# Altium schematic sheet zigbee.SchDoc
size A2
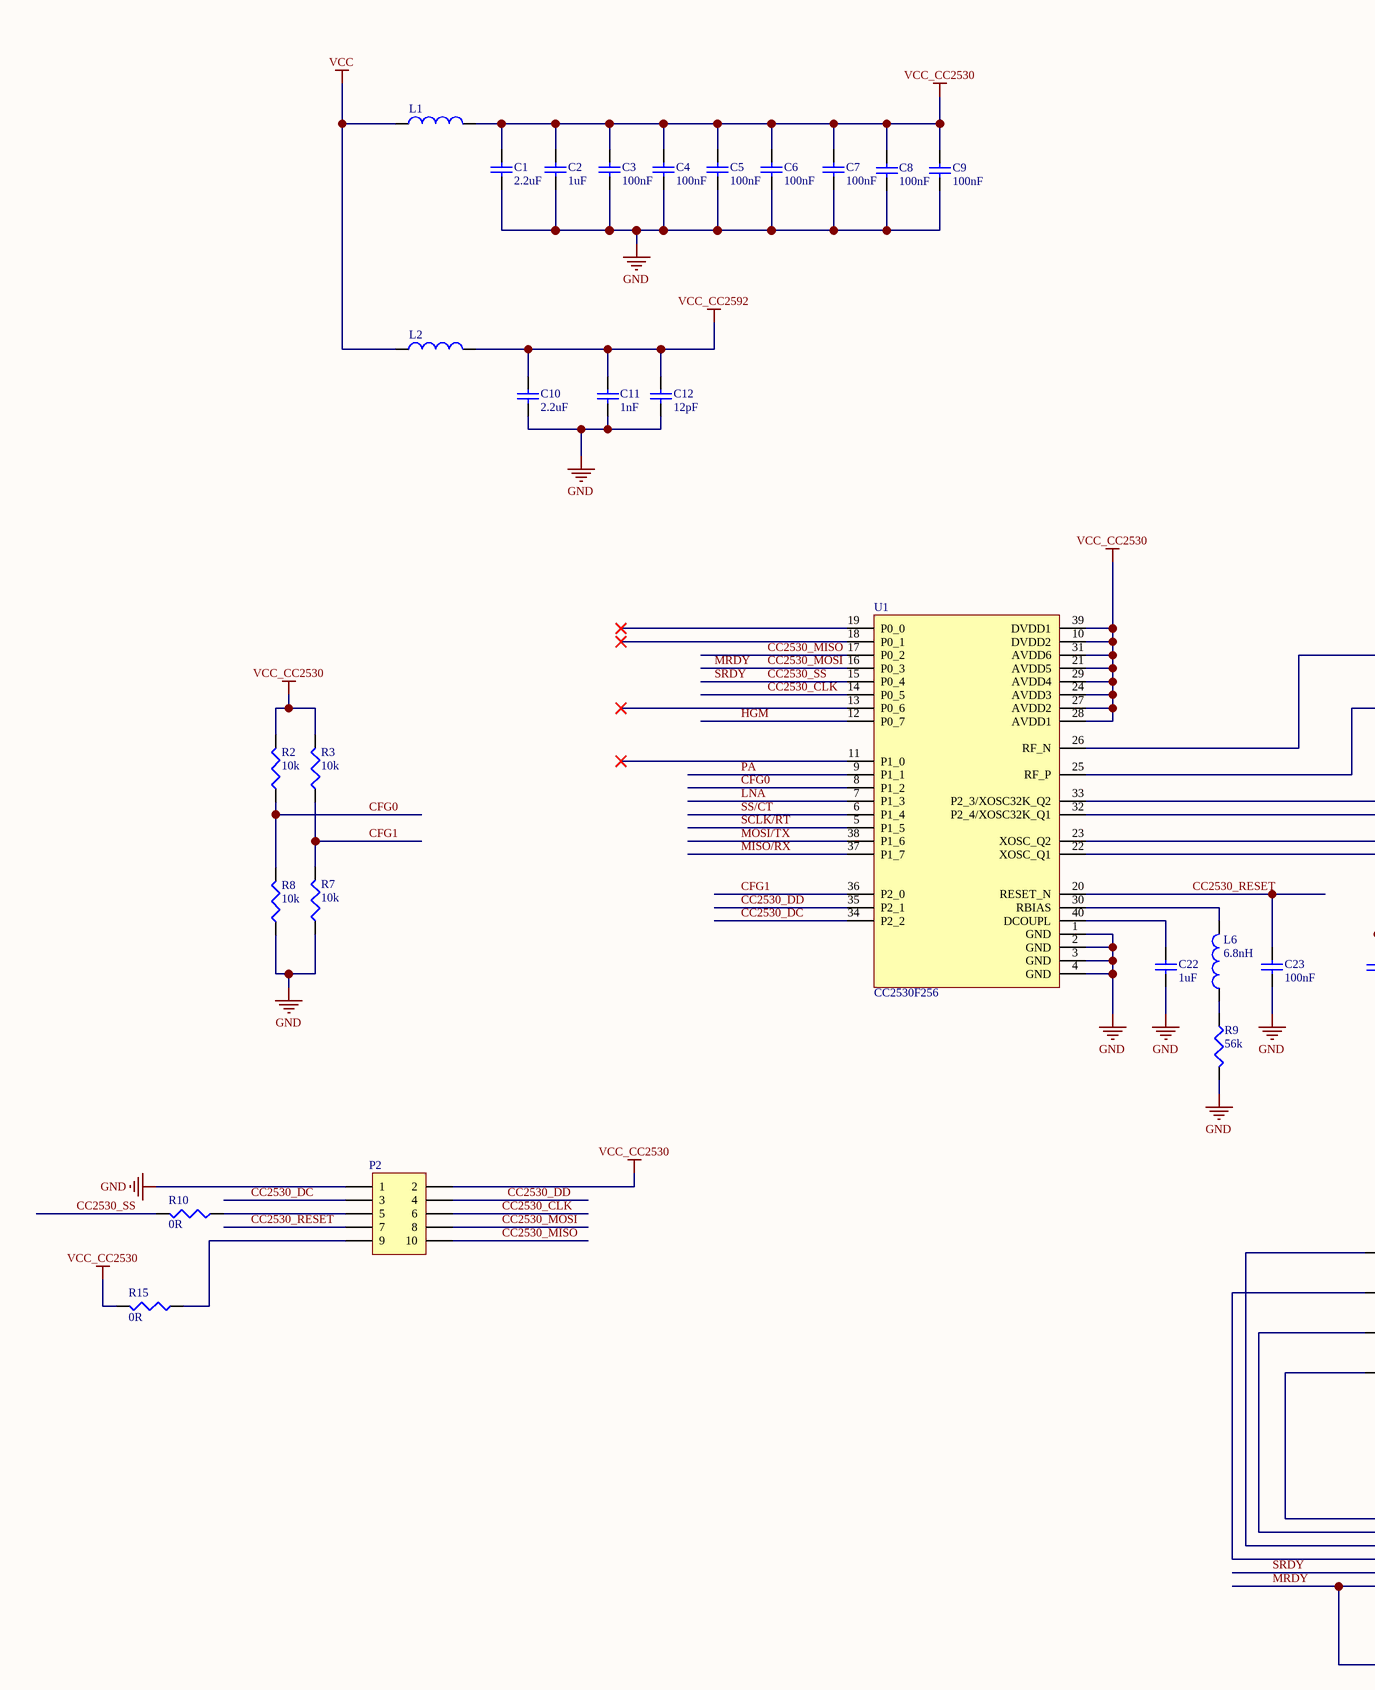
[diagram p0: zigbee.SchDoc, left]
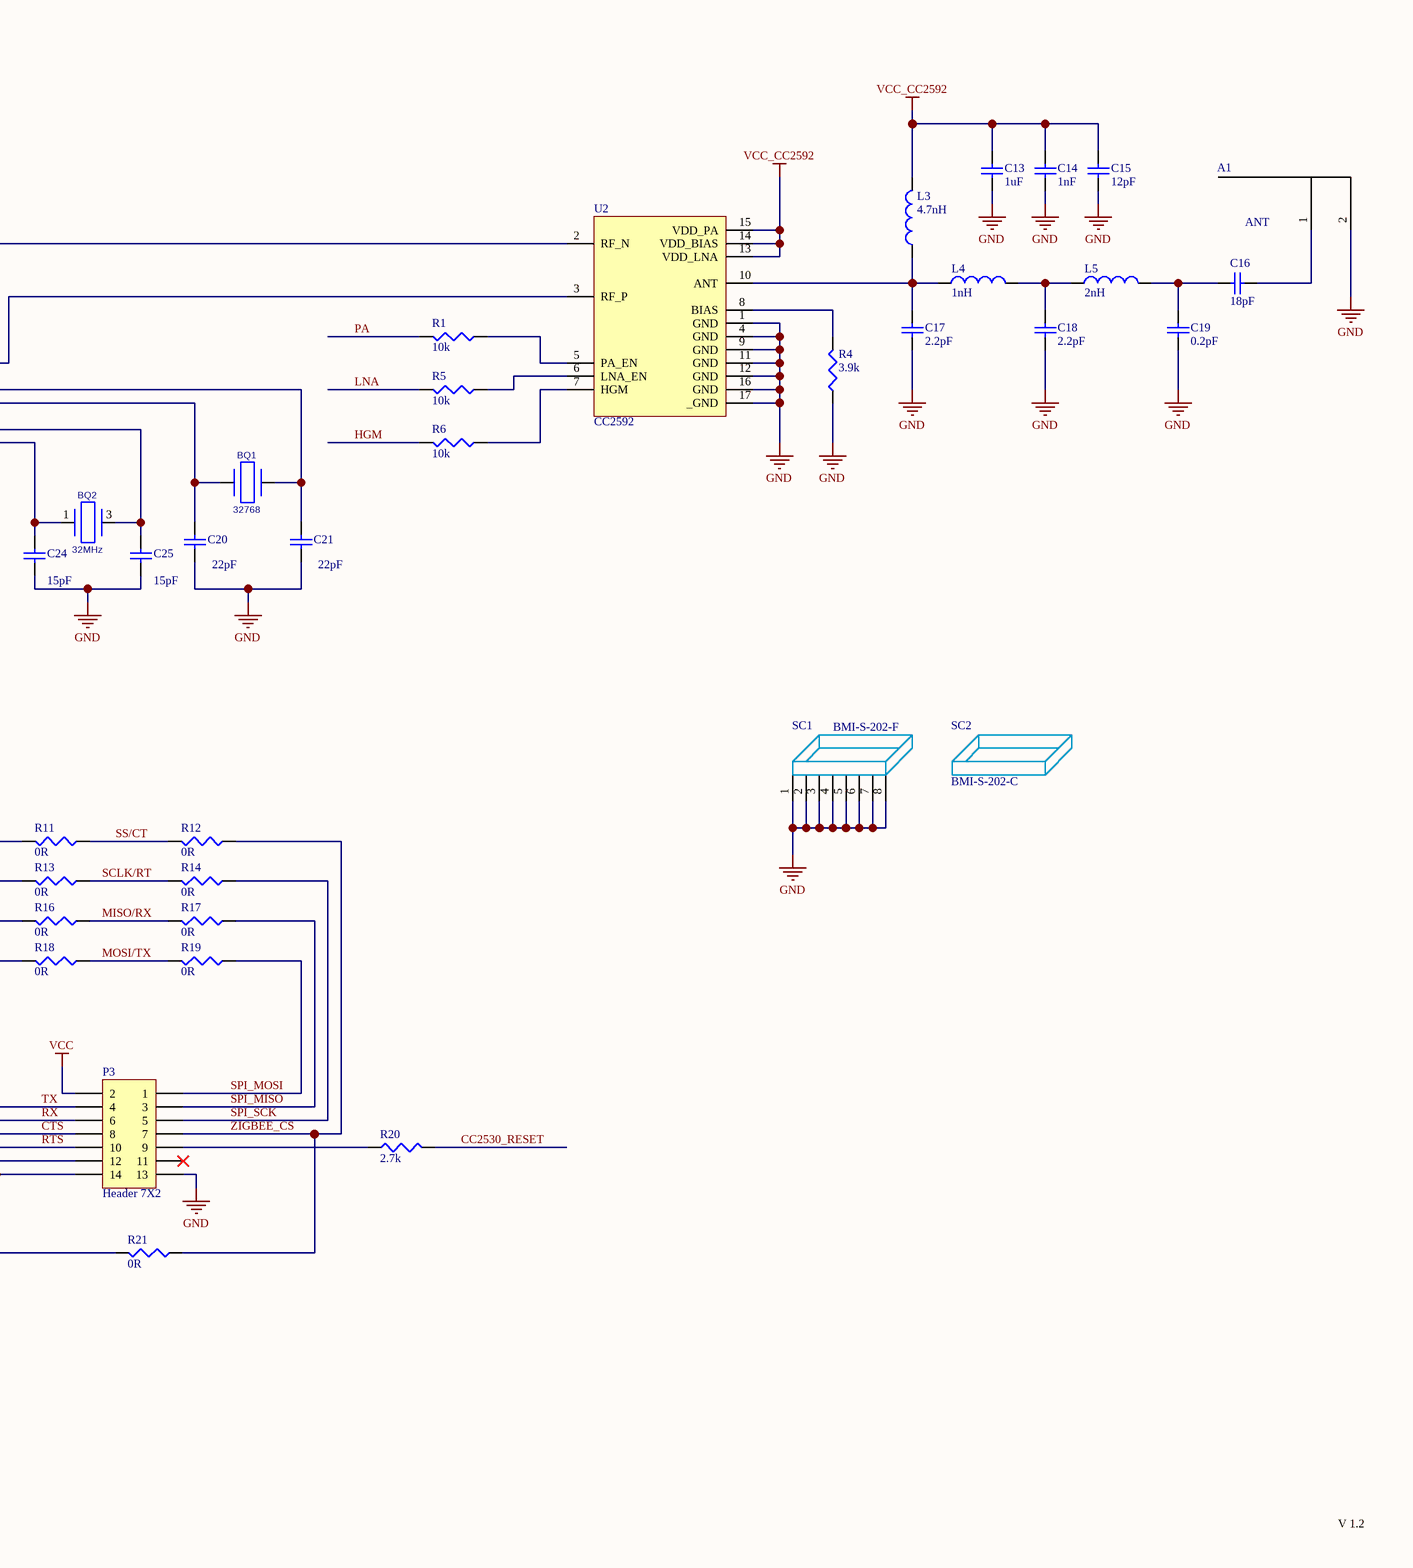
[diagram p1: zigbee.SchDoc, right]

## Parts
A1  ANT  [F ant]
BQ1  value 32768  [FC-12M]  (hidden comment: Crystal)
BQ2  value 32MHz  [403C11A32M00000]  (hidden comment: Crystal)
C1  value 2.2uF  [0402]  (hidden comment: Capacitor)
C2  value 1uF  [0402]  (hidden comment: Capacitor)
C3  value 100nF  [0402]  (hidden comment: Capacitor)
C4  value 100nF  [0402]  (hidden comment: Capacitor)
C5  value 100nF  [0402]  (hidden comment: Capacitor)
C6  value 100nF  [0402]  (hidden comment: Capacitor)
C7  value 100nF  [0402]  (hidden comment: Capacitor)
C8  value 100nF  [0402]  (hidden comment: Capacitor)
C9  value 100nF  [0402]  (hidden comment: Capacitor)
C10  value 2.2uF  [0402]  (hidden comment: Capacitor)
C11  value 1nF  [0402]  (hidden comment: Capacitor)
C12  value 12pF  [0402]  (hidden comment: Capacitor)
C13  value 1uF  [0402]  (hidden comment: Capacitor)
C14  value 1nF  [0402]  (hidden comment: Capacitor)
C15  value 12pF  [0402]  (hidden comment: Capacitor)
C16  value 18pF  [0402]  (hidden comment: Capacitor)
C17  value 2.2pF  [0402]  (hidden comment: Capacitor)
C18  value 2.2pF  [0402]  (hidden comment: Capacitor)
C19  value 0.2pF  [0402]  (hidden comment: Capacitor)
C20  value 22pF  [0402]  (hidden comment: Capacitor)
C21  value 22pF  [0402]  (hidden comment: Capacitor)
C22  value 1uF  [0402]  (hidden comment: Capacitor)
C23  value 100nF  [0402]  (hidden comment: Capacitor)
C24  value 15pF  [0402]  (hidden comment: Capacitor)
C25  value 15pF  [0402]  (hidden comment: Capacitor)
L1  Inductor  [0402]  (value not drawn)
L2  Inductor  [0603]  (value not drawn)
L3  value 4.7nH  [0402]  (hidden comment: Inductor)
L4  value 1nH  [0402]  (hidden comment: Inductor)
L5  value 2nH  [0402]  (hidden comment: Inductor)
L6  value 6.8nH  [0402]  (hidden comment: Inductor)
P2  *  [HDR2X5H]  (value not drawn)
P3  Header 7X2  [DIP14]
R1  value 10k  [0402]  (hidden comment: Resistor)
R2  value 10k  [0402]  (hidden comment: Resistor)
R3  value 10k  [0402]  (hidden comment: Resistor)
R4  value 3.9k  [0402]  (hidden comment: Resistor)
R5  value 10k  [0402]  (hidden comment: Resistor)
R6  value 10k  [0402]  (hidden comment: Resistor)
R7  value 10k  [0402]  (hidden comment: Resistor)
R8  value 10k  [0402]  (hidden comment: Resistor)
R9  value 56k  [0402]  (hidden comment: Resistor)
R10  value 0R  [0402]  (hidden comment: Blob)
R11  value 0R  [0402]  (hidden comment: Blob)
R12  value 0R  [0402]  (hidden comment: Blob)
R13  value 0R  [0402]  (hidden comment: Blob)
R14  value 0R  [0402]  (hidden comment: Blob)
R15  value 0R  [0402]  (hidden comment: Blob)
R16  value 0R  [0402]  (hidden comment: Blob)
R17  value 0R  [0402]  (hidden comment: Blob)
R18  value 0R  [0402]  (hidden comment: Blob)
R19  value 0R  [0402]  (hidden comment: Blob)
R20  value 2.7k  [0402]  (hidden comment: Resistor)
R21  value 0R  [0402]  (hidden comment: Blob)
SC1  BMI-S-202-F  [BMIS_202_F]
SC2  BMI-S-202-C
U1  CC2530F256  [QFN40]
U2  CC2592  [QFN16]

## Nets
GND: A1.2 C1.2 C2.2 C3.2 C4.2 C5.2 C6.2 C7.2 C8.2 C9.2 C10.2 C11.1 C12.1 C13.1 C14.1 C15.1 C17.1 C18.1 C19.1 C20.1 C21.1 C22.2 C23.2 C24.1 C25.1 P2.1 P3.13 R4.1 R7.2 R8.2 R9.2 SC1.1 SC1.2 SC1.3 SC1.4 SC1.5 SC1.6 SC1.7 SC1.8 U1.1(GND) U1.2(GND) U1.3(GND) U1.4(GND) U2.1(GND) U2.4(GND) U2.9(GND) U2.11(GND) U2.12(GND) U2.16(GND) U2.17(_GND)
VCC: L1.1 L2.1 P3.2
VCC_CC2530: C1.1 C2.1 C3.1 C4.1 C5.1 C6.1 C7.1 C8.1 C9.1 L1.2 P2.2 R2.1 R3.1 R15.2 U1.10(DVDD2) U1.21(AVDD5) U1.24(AVDD3) U1.27(AVDD2) U1.28(AVDD1) U1.29(AVDD4) U1.31(AVDD6) U1.39(DVDD1)
VCC_CC2592: C10.1 C11.2 C12.2 C13.2 C14.2 C15.2 L2.2 L3.2 U2.13(VDD_LNA) U2.14(VDD_BIAS) U2.15(VDD_PA)
CC2530_CLK: P2.6 U1.14(P0_5)
CC2530_DC: P2.3 U1.34(P2_2)
CC2530_DD: P2.4 U1.35(P2_1)
CC2530_MISO: P2.10 U1.17(P0_2)
CC2530_MOSI: P2.8 P3.14 R21.2 U1.16(P0_3)  [also labelled MRDY]
CC2530_RESET: C23.1 P2.7 R20.1 U1.20(RESET_N)
CC2530_SS: P3.12 R10.2 U1.15(P0_4)  [also labelled SRDY]
CFG0: R2.2 R8.1 U1.8(P1_2)
CFG1: R3.2 R7.1 U1.36(P2_0)
CTS: P3.8 R11.2
HGM: R6.1 U1.12(P0_7)
LNA: R5.1 U1.7(P1_3)
MISO/RX: R16.1 R17.2 U1.37(P1_7)
MOSI/TX: R18.1 R19.2 U1.38(P1_6)
PA: R1.1 U1.9(P1_1)
RTS: P3.10 R13.2
RX: P3.6 R16.2
SCLK/RT: R13.1 R14.2 U1.5(P1_5)
SPI_MISO: P3.3 R17.1
SPI_MOSI: P3.1 R19.1
SPI_SCK: P3.5 R14.1
SS/CT: R11.1 R12.2 U1.6(P1_4)
TX: P3.4 R18.2
ZIGBEE_CS: P3.7 R12.1 R21.1
NetA1_1: A1.1 C16.2
NetBQ1_1: BQ1.1 C20.2 U1.32(P2_4/XOSC32K_Q1)
NetBQ1_2: BQ1.2 C21.2 U1.33(P2_3/XOSC32K_Q2)
NetBQ2_1: BQ2.1 C24.2 U1.22(XOSC_Q1)
NetBQ2_3: BQ2.3 C25.2 U1.23(XOSC_Q2)
NetC16_1: C16.1 C19.2 L5.2
NetC17_2: C17.2 L3.1 L4.1 U2.10(ANT)
NetC18_2: C18.2 L4.2 L5.1
NetC22_1: C22.1 U1.40(DCOUPL)
NetL6_1: L6.1 R9.1
NetL6_2: L6.2 U1.30(RBIAS)
NetP2_5: P2.5 R10.1
NetP2_9: P2.9 R15.1
NetP3_9: P3.9 R20.2
NetR1_2: R1.2 U2.5(PA_EN)
NetR4_2: R4.2 U2.8(BIAS)
NetR5_2: R5.2 U2.6(LNA_EN)
NetR6_2: R6.2 U2.7(HGM)
NetU1_25: U1.25(RF_P) U2.3(RF_P)
NetU1_26: U1.26(RF_N) U2.2(RF_N)

Not connected (* = marked no-connect by the designer): P3 11*; U1 11(P1_0)* 13(P0_6)* 18(P0_1)* 19(P0_0)*

## Notes on the sheet
- V 1.2

## Library data of the parts
A1 = ANT: Inverted-F Antenna; Manufacturer Part Number: PCB ANT; Mount: 1; Manufacturer: *
BQ1 = 6LC:308C: CRYSTAL 32.768KHZ 12.5PF SMD; Manufacturer Part Number: FC-12M 32.7680KA-A3; Manufacturer: EPSON; Mount: 1
BQ2 = HC-49SMD: CRYSTAL 32MHZ 10PF SMD; Manufacturer: CTS-Frequency Controls; Manufacturer Part Number: 403C11A32M00000; Mount: 1
C1 C10 = Cap: CAP CER 2.2UF 6.3V 20% X5R 0402; Manufacturer Part Number: CL05A225MQ5NNNC; Manufacturer: Samsung Electro-Mechanics America, Inc; Mount: 1
C2 C13 C22 = Cap: CAP CER 1UF 6.3V 10% X5R 0402; Manufacturer Part Number: GRM155R60J105KE19D; Manufacturer: Murata Electronics North America; Mount: 1
C3-C9 C23 = Cap: CAP CER 0.1UF 10V 20% X5R 0402; Manufacturer Part Number: CL05A104MP5NNNC; Manufacturer: Samsung Electro-Mechanics America, Inc; Mount: 1
C11 C14 = Cap: CAP CER 10000PF 10V 10% X5R 0402; Manufacturer Part Number: GRM155R61A103KA01D; Manufacturer: Murata Electronics North America; Mount: 1
C12 C15 = Cap: CAP CER 12PF 50V 5% NP0 0402; Manufacturer Part Number: GRM1555C1H120JA01D; Manufacturer: Murata Electronics North America; Mount: 1
C16 = Cap: CAP CER 18PF 50V 5% NP0 0402; Manufacturer Part Number: GRM1555C1H180JA01D; Manufacturer: Murata Electronics North America; Mount: 1
C17 C18 = Cap: CAP CER 2.2PF 50V NP0 0402; Manufacturer Part Number: GRM1555C1H2R2BA01D; Manufacturer: Murata Electronics North America; Mount: 1
C19 = Cap: CAP CER 0.2PF 50V NP0 0402; Manufacturer Part Number: GJM1555C1HR20BB01D; Manufacturer: Murata Electronics North America; Mount: 1
C20 C21 = Cap: CAP CER 22PF 50V 5% NP0 0402; Manufacturer Part Number: GRM1555C1H220JA01D; Manufacturer: Murata Electronics North America; Mount: 1
C24 C25 = Cap: CAP CER 15PF 50V 5% NP0 0402; Manufacturer Part Number: GRM1555C1H150JA01D; Manufacturer: Murata Electronics North America; Mount: 1
L1 = Inductor: FILTER CHIP 1000 OHM 250MA 0402; Manufacturer Part Number: BLM15HG102SN1D; Manufacturer: Murata Electronics North America; Mount: 1
L2 = Inductor: FILTER CHIP 1000 OHM 250MA 0603; Manufacturer Part Number: BLM18HE152SN1D; Manufacturer: Murata Electronics North America; Mount: 1
L3 = Inductor: INDUCTOR 4.7NH 300MA 0402; Manufacturer Part Number: LQG15HN4N7S02D; Manufacturer: Murata Electronics North America; Mount: 1
L4 = Inductor: INDUCTOR 1.0NH 300MA 0402; Manufacturer Part Number: LQG15HN1N0S02D; Manufacturer: Murata Electronics North America; Mount: 1
L5 = Inductor: INDUCTOR 2.0NH 300MA 0402; Manufacturer Part Number: LQG15HS2N0S02D; Manufacturer: Murata Electronics North America; Mount: 1
L6 = Inductor: INDUCTOR 6.8NH 300MA 0402; Manufacturer Part Number: LQG15HS6N8J02D; Manufacturer: Murata Electronics North America; Mount: 1
P2 = Header 5X2: CONN HEADER R/A DUAL 10POS GOLD; Manufacturer Part Number: 961210-5604-AR; Manufacturer: 3M; Mount: 1
P3 = Header 7X2: BERGSTIK II .100" DR STRAIGHT; Manufacturer Part Number: 67996-114HLF; Manufacturer: FCI; Mount: 1
R1-R3 R5-R8 = Res3: RES 10K OHM 1/10W 5% 0402 SMD; Manufacturer Part Number: ERJ-2GEJ103X; Manufacturer: Panasonic Electronic Components
  R1 R2 R5-R7: Mount: 1
  R3 R8: Mount: 0
R4 = Res3: RES 3.9K OHM 1/10W 1% 0402 SMD; Manufacturer Part Number: ERJ-2RKF3901X; Manufacturer: Panasonic Electronic Components; Mount: 1
R9 = Res3: RES 56K OHM 1/10W 1% 0402 SMD; Manufacturer Part Number: ERJ-2RKF5602X; Manufacturer: Panasonic Electronic Components; Mount: 1
R10-R19 R21 = Res3: RES 0.0 OHM 1/10W JUMP 0402 SMD; Manufacturer Part Number: ERJ-2GE0R00X; Manufacturer: Panasonic Electronic Components
  R10 R12 R14 R15 R17 R19 R21: Mount: 0
  R11 R13 R16 R18: Mount: 1
R20 = Res3: RES 2.7K OHM 1/10W 5% 0402 SMD; Manufacturer Part Number: ERJ-2GEJ272X; Manufacturer: Panasonic Electronic Components; Mount: 1
SC1 = BMI-S-202-F: BOARD SHIELD .65X.65" FRAME; Manufacturer: Laird Technologies EMI; Manufacturer Part Number: BMI-S-202-F; Mount: 1
SC2 = BMI-S-202-C: BOARD SHIELD .65X.65" COVER; Manufacturer: Laird Technologies EMI; Mount: 1; Manufacturer Part Number: BMI-S-202-C
U1 = CC2530F256: IC SOC IEEE 802.15.4/ZIG 40VQFN; Manufacturer Part Number: CC2530F256RHAT; Manufacturer: Texas Instruments; Mount: 1
U2 = CC2592: IC RF FRONT END 2.4GHZ 16-VQFN; Manufacturer Part Number: CC2592RGVT; Manufacturer: Texas Instruments; Mount: 1